# Altium project ESP32_LORA.PrjPcb
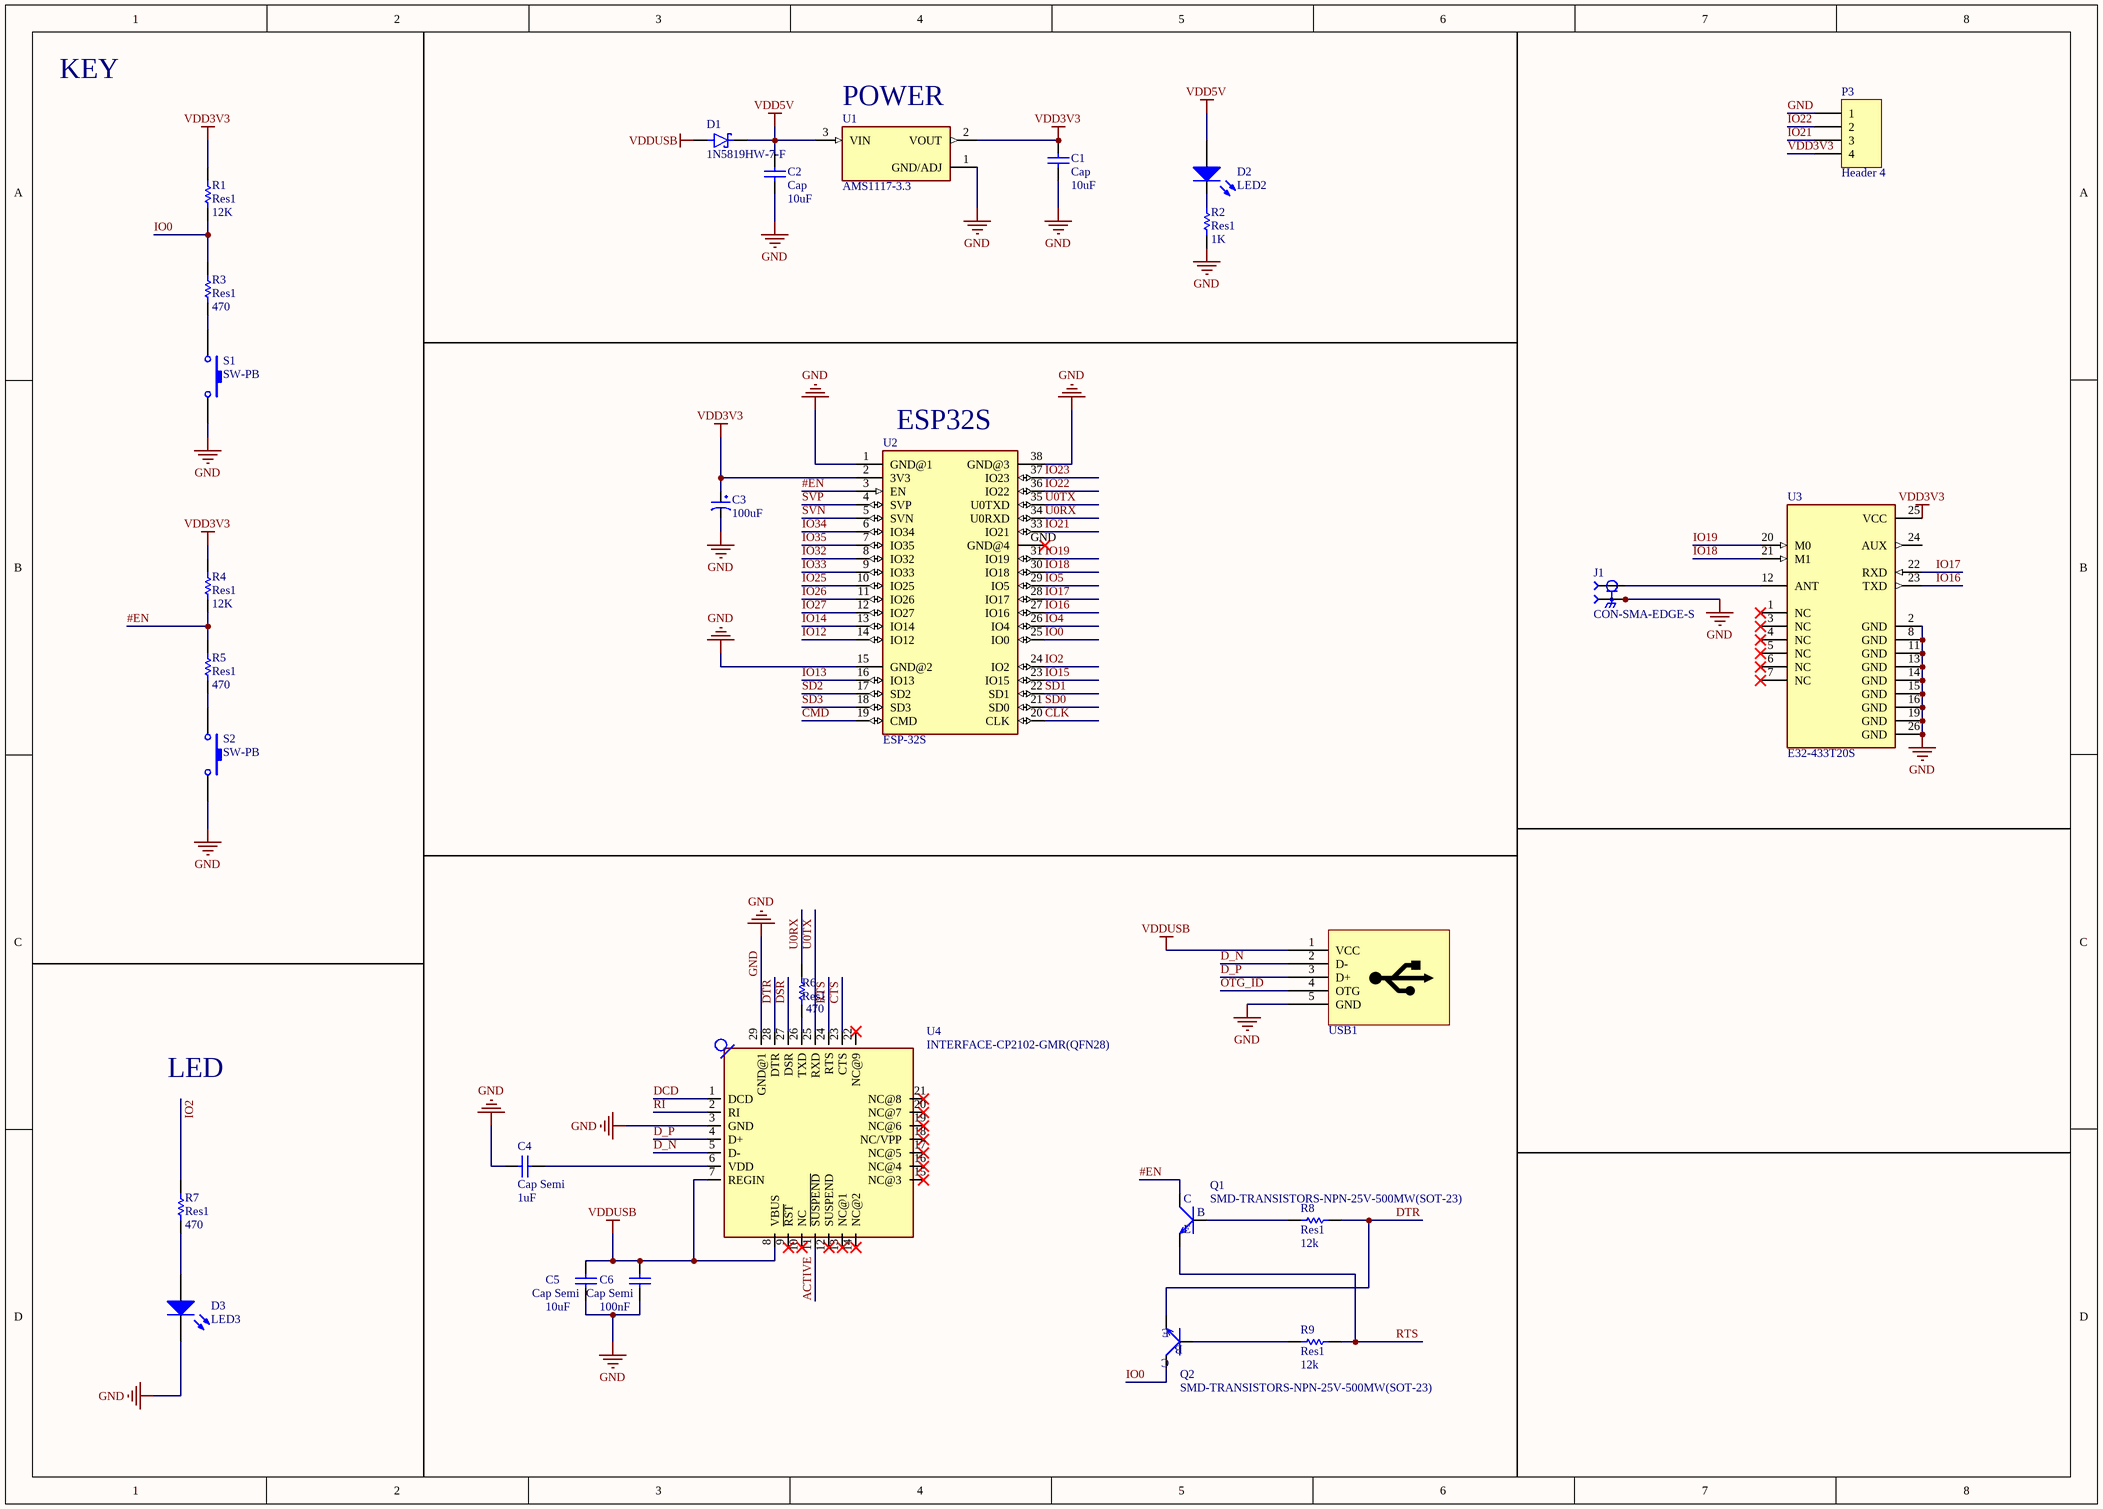
[diagram p0: GATEWAY.SchDoc]
1 sheet, 29 parts. Net scope: global (net labels, ports and power ports of the same name join across sheets).
Board files: PCBgateway.PcbDoc, ESP32_NHAN.PcbDoc

## Sheet GATEWAY.SchDoc
size A3; SheetNumber: 1; SheetTotal: 1

### Parts
C1  Cap  value 10uF  [Tu 0805]
C2  Cap  value 10uF  [Tu 0805]
C3  100uF  [tu tantalum smd6032]
C4  Cap Semi  value 1uF  [Tu 0805]
C5  Cap Semi  value 10uF  [Tu 0805]
C6  Cap Semi  value 100nF  [Tu 0805]
D1  1N5819HW-7-F  [SOD3715X145N]
D2  LED2  [led 0805]
D3  LED3  [led 0805]
J1  CON-SMA-EDGE-S  [RFSOLUTIONS_CON-SMA-EDGE-S]
P3  Header 4  [HDR1X4]
Q1  SMD-TRANSISTORS-NPN-25V-500MW(SOT-23)  [SOT-23]
Q2  SMD-TRANSISTORS-NPN-25V-500MW(SOT-23)  [SOT-23]
R1  Res1  value 12K  [Tro SMD 0805]
R2  Res1  value 1K  [Tro SMD 0805]
R3  Res1  value 470  [Tro SMD 0805]
R4  Res1  value 12K  [Tro SMD 0805]
R5  Res1  value 470  [Tro SMD 0805]
R6  Res1  value 470  [Tro SMD 0805]
R7  Res1  value 470  [Tro SMD 0805]
R8  Res1  value 12k  [Tro SMD 0805]
R9  Res1  value 12k  [Tro SMD 0805]
S1  SW-PB  [SW-SMD]
S2  SW-PB  [SW-SMD]
U1  AMS1117-3.3  [SOT229P700X180-4N]
U2  ESP-32S  [ESP-32S]
U3  E32-433T20S  [MODULE_E32-433T20S]
U4  INTERFACE-CP2102-GMR(QFN28)  [QFN28G_0.5-5X5MM]
USB1  MiniUSB 5P SMD  [USB-B-Mini]  (value not drawn)

### Nets
GND: C1.2 C2.1 C3.2 C4.1 C5.1 C6.1 D3.2(K) J1.G1 J1.G2 J1.G3 J1.G4 P3.1 R2.1 S1.2 S2.2 U1.1(GND/ADJ) U2.1(GND@1) U2.15(GND@2) U2.38(GND@3) U3.2(GND) U3.8(GND) U3.11(GND) U3.13(GND) U3.14(GND) U3.15(GND) U3.16(GND) U3.19(GND) U3.26(GND) U4.3(GND) U4.29(GND@1) USB1.5(GND)
VDD3V3: C1.1 C3.1 P3.4 R1.2 R4.2 U1.2(VOUT) U2.2(3V3) U3.25(VCC)
VDD5V: C2.2 D1.C(K) D2.1(A) U1.3(VIN)
VDDUSB: C5.2 C6.2 D1.A U4.7(REGIN) U4.8(VBUS) USB1.1(VCC)
#EN: Q1.3(C) R4.1 R5.2 U2.3(EN)
ACTIVE: U4.11(~{SUSPEND})
CLK: U2.20(CLK)
CMD: U2.19(CMD)
CTS: U4.23(CTS)
D_N: U4.5(D-) USB1.2(D-)
D_P: U4.4(D+) USB1.3(D+)
DCD: U4.1(DCD)
DSR: U4.27(DSR)
DTR: Q2.2(E) R8.2 U4.28(DTR)
IO0: Q2.3(C) R1.1 R3.2 U2.25(IO0)
IO2: R7.2 U2.24(IO2)
IO4: U2.26(IO4)
IO5: U2.29(IO5)
IO12: U2.14(IO12)
IO13: U2.16(IO13)
IO14: U2.13(IO14)
IO15: U2.23(IO15)
IO16: U2.27(IO16) U3.23(TXD)
IO17: U2.28(IO17) U3.22(RXD)
IO18: U2.30(IO18) U3.21(M1)
IO19: U2.31(IO19) U3.20(M0)
IO21: P3.3 U2.33(IO21)
IO22: P3.2 U2.36(IO22)
IO23: U2.37(IO23)
IO25: U2.10(IO25)
IO26: U2.11(IO26)
IO27: U2.12(IO27)
IO32: U2.8(IO32)
IO33: U2.9(IO33)
IO34: U2.6(IO34)
IO35: U2.7(IO35)
OTG_ID: USB1.4(OTG)
RI: U4.2(RI)
RTS: Q1.2(E) R9.2 U4.24(RTS)
SD0: U2.21(SD0)
SD1: U2.22(SD1)
SD2: U2.17(SD2)
SD3: U2.18(SD3)
SVN: U2.5(SVN)
SVP: U2.4(SVP)
U0RX: R6.2 U2.34(U0RXD)
U0TX: U2.35(U0TXD) U4.25(RXD)
NetC4_2: C4.2 U4.6(VDD)
NetD2_2: D2.2(K) R2.2
NetD3_1: D3.1(A) R7.1
NetJ1_1: J1.1 U3.12(ANT)
NetQ1_1: Q1.1(B) R8.1
NetQ2_1: Q2.1(B) R9.1
NetR3_1: R3.1 S1.1
NetR5_1: R5.1 S2.1
NetR6_1: R6.1 U4.26(TXD)

Not connected (* = marked no-connect by the designer): U2 GND(GND@4)*; U3 1(NC)* 3(NC)* 4(NC)* 5(NC)* 6(NC)* 7(NC)* 24(AUX); U4 9(~{RST})* 10(NC)* 12(SUSPEND)* 13(NC@1)* 14(NC@2)* 15(NC@3)* 16(NC@4)* 17(NC@5)* 18(NC/VPP)* 19(NC@6)* 20(NC@7)* 21(NC@8)* 22(NC@9)*

### Notes on the sheet
- KEY
- (near U1) POWER
- (near U2) ESP32S
- LED

### Library data of the parts
C1 C2 = Cap: Capacitor; Published: 8-Jun-2000; LatestRevisionDate: 17-Jul-2002; LatestRevisionNote: Re-released for DXP Platform.; PackageReference: RAD-0.3; Publisher: Altium Limited; PackageDescription: Radial Cap, Thru-Hole; 2 Leads; 0.3 in Pin Spacing
C3 = Tu tantalum 100uF 10V SMD6032: Dán; Don_Vi: Con; So_Chan: 2; Ten_Linh_Kien: Tụ tantalum 107A-100uF 10V SMD6032; Ma_Hang: MH007594; Chung_Loai: Dán; Kieu_Chan: *
C4-C6 = Cap Semi: Capacitor (Semiconductor SIM Model); Published: 8-Jun-2000; LatestRevisionDate: 29-May-2009; LatestRevisionNote: IPC-7351 Footprint Added.; PackageReference: C1206; Publisher: Altium Limited; PackageDescription: Chip Capacitor
D1 = 1N5819HW-7-F: Diode Schottky 40 V 1A Surface Mount SOD-123; MF: Diodes Inc.; Value: *; SnapEDA_Link: https://www.snapeda.com/parts/1N5819HW-7-F/Diodes+Inc./view-part/?ref=snap; Purchase-URL: https://pricing.snapeda.com/search/part/1N5819HW-7-F/?ref=eda; Availability: In Stock; Price: None; Package: SOD-123 Fairchild Semiconductor; Check_prices: https://www.snapeda.com/parts/1N5819HW-7-F/Diodes+Inc./view-part/?ref=eda; MP: 1N5819HW-7-F
D2 = LED2: Typical RED, GREEN, YELLOW, AMBER GaAs LED; Published: 8-Jun-2000; LatestRevisionDate: 17-Jul-2002; LatestRevisionNote: Re-released for DXP Platform.; PackageVersion: Feb-2002; PackageReference: 3.2X1.6X1.1; Publisher: Altium Limited; PackageDescription: SM LED; 2 Flat Leads
D3 = LED3: Typical BLUE SiC LED; Published: 8-Jun-2000; LatestRevisionDate: 17-Dec-2003; LatestRevisionNote: PCB Footprint replaced.; DatasheetVersion: 16-Apr-2002; PackageVersion: 16-Apr-2002; PackageReference: 3.5X2.8X1.9; Publisher: Altium Limited; PackageDescription: SM LED; 2 C-Bend Leads; Body 3.5 x 2.8 x 1.9 mm, inc leads (LxWxH typ)
J1 = CON-SMA-EDGE-S: SMA Connector Jack, Female Socket - Board Edge, End Launch Solder; MF: RF Solutions; Value: *; SnapEDA_Link: https://www.snapeda.com/parts/CON-SMA-EDGE-S/RF+Solutions/view-part/?ref=snap; Purchase-URL: https://pricing.snapeda.com/search/part/CON-SMA-EDGE-S/?ref=eda; Check_prices: https://www.snapeda.com/parts/CON-SMA-EDGE-S/RF+Solutions/view-part/?ref=eda; Digi-Key_Part_Number: CON-SMA-EDGE-S-ND; Package: None; MP: CON-SMA-EDGE-S
P3 = Header 4: Header, 4-Pin; LatestRevisionDate: 17-Jul-2002; LatestRevisionNote: Re-released for DXP Platform.; Publisher: Altium Limited
Q1 Q2 = SMD-TRANSISTORS-NPN-25V-500MW(SOT-23): Bipolar (BJT) Transistor NPN 25 V 500 mA 150MHz 300 mW Surface Mount SOT-23; MF: UMW; MP: S8050; Purchase-URL: https://pricing.snapeda.com/search/part/S8050/?ref=eda; Check_prices: https://www.snapeda.com/parts/S8050/Umwelt+Sensor+Teknik/view-part/?ref=eda; SnapEDA_Link: https://www.snapeda.com/parts/S8050/Umwelt+Sensor+Teknik/view-part/?ref=snap; Price: None; Availability: In Stock; Package: None; Value: *
R1-R9 = Res1: Resistor; Published: 8-Jun-2000; LatestRevisionDate: 17-Jul-2002; LatestRevisionNote: Re-released for DXP Platform.; PackageReference: AXIAL-0.3; Publisher: Altium Limited; PackageDescription: Axial Device, Thru-Hole; 2 Leads; 0.3 in Pin Spacing
S1 S2 = SW-PB: Switch; Published: 24-Mar-1999; LatestRevisionDate: 17-Jul-2002; LatestRevisionNote: Re-released for DXP Platform.; PackageReference: SPST-2; Publisher: Altium Limited; PackageDescription: Switch; 2 Leads
U1 = AMS1117-3.3: Sot223/Pkg 1-Amp 3.3-Volt Low Drop Out Voltage Regulatator; MF: Advanced Monolithic Systems; Package: SOT-223 Seeed Technology; Value: *; Check_prices: https://www.snapeda.com/parts/AMS1117-3.3/Advanced+Monolithic+Systems/view-part/?ref=eda; Price: None; Availability: Not in stock; MP: AMS1117-3.3; SnapEDA_Link: https://www.snapeda.com/parts/AMS1117-3.3/Advanced+Monolithic+Systems/view-part/?ref=snap
U2 = ESP-32S: - - Transceiver Module - - Surface Mount; MF: Olimex LTD; SnapEDA_Link: https://www.snapeda.com/parts/ESP-32S/Olimex+LTD/view-part/?ref=snap; Package: None; Value: *; MP: ESP-32S; Check_prices: https://www.snapeda.com/parts/ESP-32S/Olimex+LTD/view-part/?ref=eda
U3 = E32-433T20S: Wireless serial port module (UART); MF: EBYTE; Check_prices: https://www.snapeda.com/parts/E32-433T20S/EBYTE/view-part/?ref=eda; Package: Package; MP: E32-433T20S; Value: *; SnapEDA_Link: https://www.snapeda.com/parts/E32-433T20S/EBYTE/view-part/?ref=snap; Price: None; Availability: Not in stock
U4 = INTERFACE-CP2102-GMR(QFN28): USB Bridge, USB to UART USB 2.0 UART Interface 28-QFN (5x5); MF: Silicon; Price: None; Availability: In Stock; MP: CP2102-GMR; Package: VFQFN-28 Vishay Siliconix; SnapEDA_Link: https://www.snapeda.com/parts/CP2102-GMR/Silicon+Labs/view-part/?ref=snap; Check_prices: https://www.snapeda.com/parts/CP2102-GMR/Silicon+Labs/view-part/?ref=eda; Value: *; Purchase-URL: https://pricing.snapeda.com/search/part/CP2102-GMR/?ref=eda
USB1 = USB_MINI: Dán; Ma_Hang: MH001022; Don_Vi: Con; Ten_Linh_Kien: MiniUSB 5P SMD; Kieu_Chan: *; Chung_Loai: Dán; Ghi_Chu: *